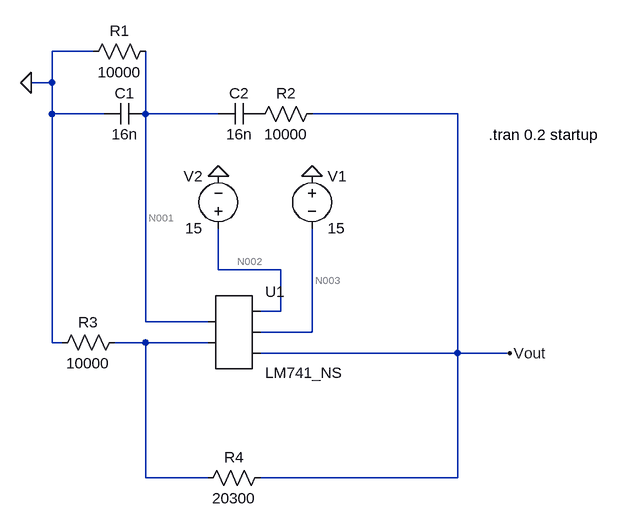
[diagram p0: schematic ee18btech11044.asc]
* ee18btech11044.asc
* U1: LM741_NS (symbol AutoGenerated\LM741_NS not available, pins judged from their places): pin1=N001 pin2=N004 pin3=N002 pin4=N003 pin5=Vout
C1 N001 0 16n
R1 N001 0 10000
C2 P001 N001 16n
R2 Vout P001 10000
V1 0 N003 15
V2 N002 0 15
R3 N004 0 10000
R4 Vout N004 20300
.tran 0.2 startup
.backanno
.end

* Results of the author's LTspice run, read from the files saved beside the schematic
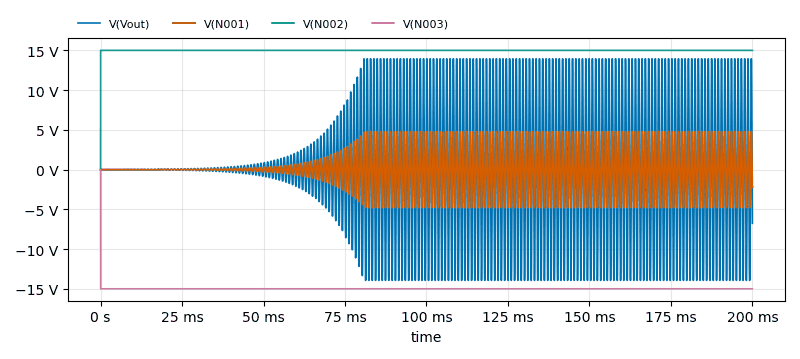
[diagram p1: Transient Analysis of ee18btech11044.asc, plotted from the saved traces]
* Transient Analysis, 1 run:
*   V(Vout): min -13.94 V, max 13.94 V, average 13.68 mV, rms 8.007 V, last -6.763 V
*   V(N001): min -4.792 V, max 4.79 V, average 2.946 mV, rms 2.667 V, last -2.247 V
*   V(N002): min 0 V, max 15 V, average 15 V, rms 15 V, last 15 V
*   V(N003): min -15 V, max 0 V, average -15 V, rms 15 V, last -15 V